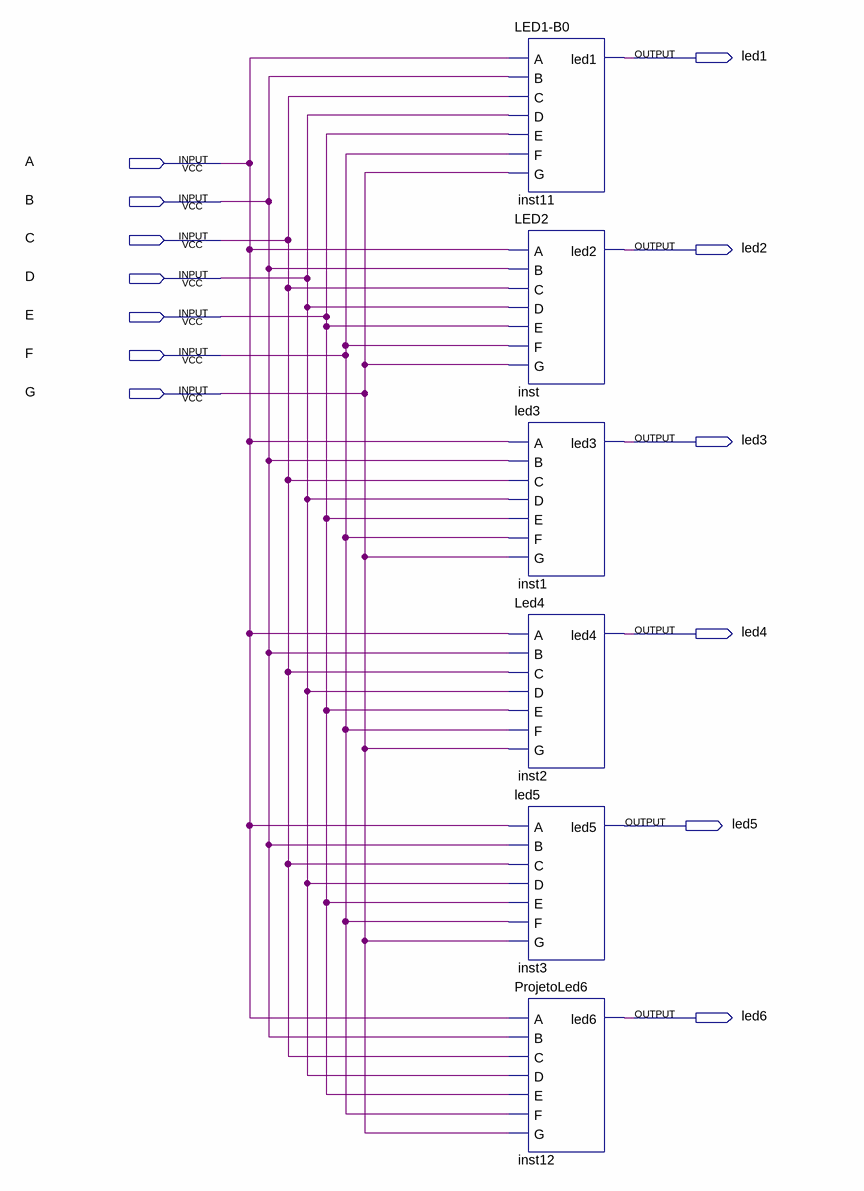
[diagram p0: schematic sheet]
// Quartus schematic pbl.bdf as structural Verilog: 6 symbols, 13 pins
module pbl (
  input  A,
  input  B,
  input  C,
  input  D,
  input  E,
  input  F,
  input  G,
  output led1,
  output led2,
  output led3,
  output led4,
  output led5,
  output led6
);

  \LED1-B0  inst11 (.A(A), .B(B), .C(C), .D(D), .E(E), .F(F), .G(G), .led1(led1));
  LED2 inst (.A(A), .B(B), .C(C), .D(D), .E(E), .F(F), .G(G), .led2(led2));
  led3 inst1 (.A(A), .B(B), .C(C), .D(D), .E(E), .F(F), .G(G), .led3(led3));
  Led4 inst2 (.A(A), .B(B), .C(C), .D(D), .E(E), .F(F), .G(G), .led4(led4));
  led5 inst3 (.A(A), .B(B), .C(C), .D(D), .E(E), .F(F), .G(G), .led5(led5));
  ProjetoLed6 inst12 (.A(A), .B(B), .C(C), .D(D), .E(E), .F(F), .G(G), .led6(led6));
endmodule
